# Altium schematic sheet ESP32墨水屏开发板_2023-03-20.schdoc
size 439 x 307 mm
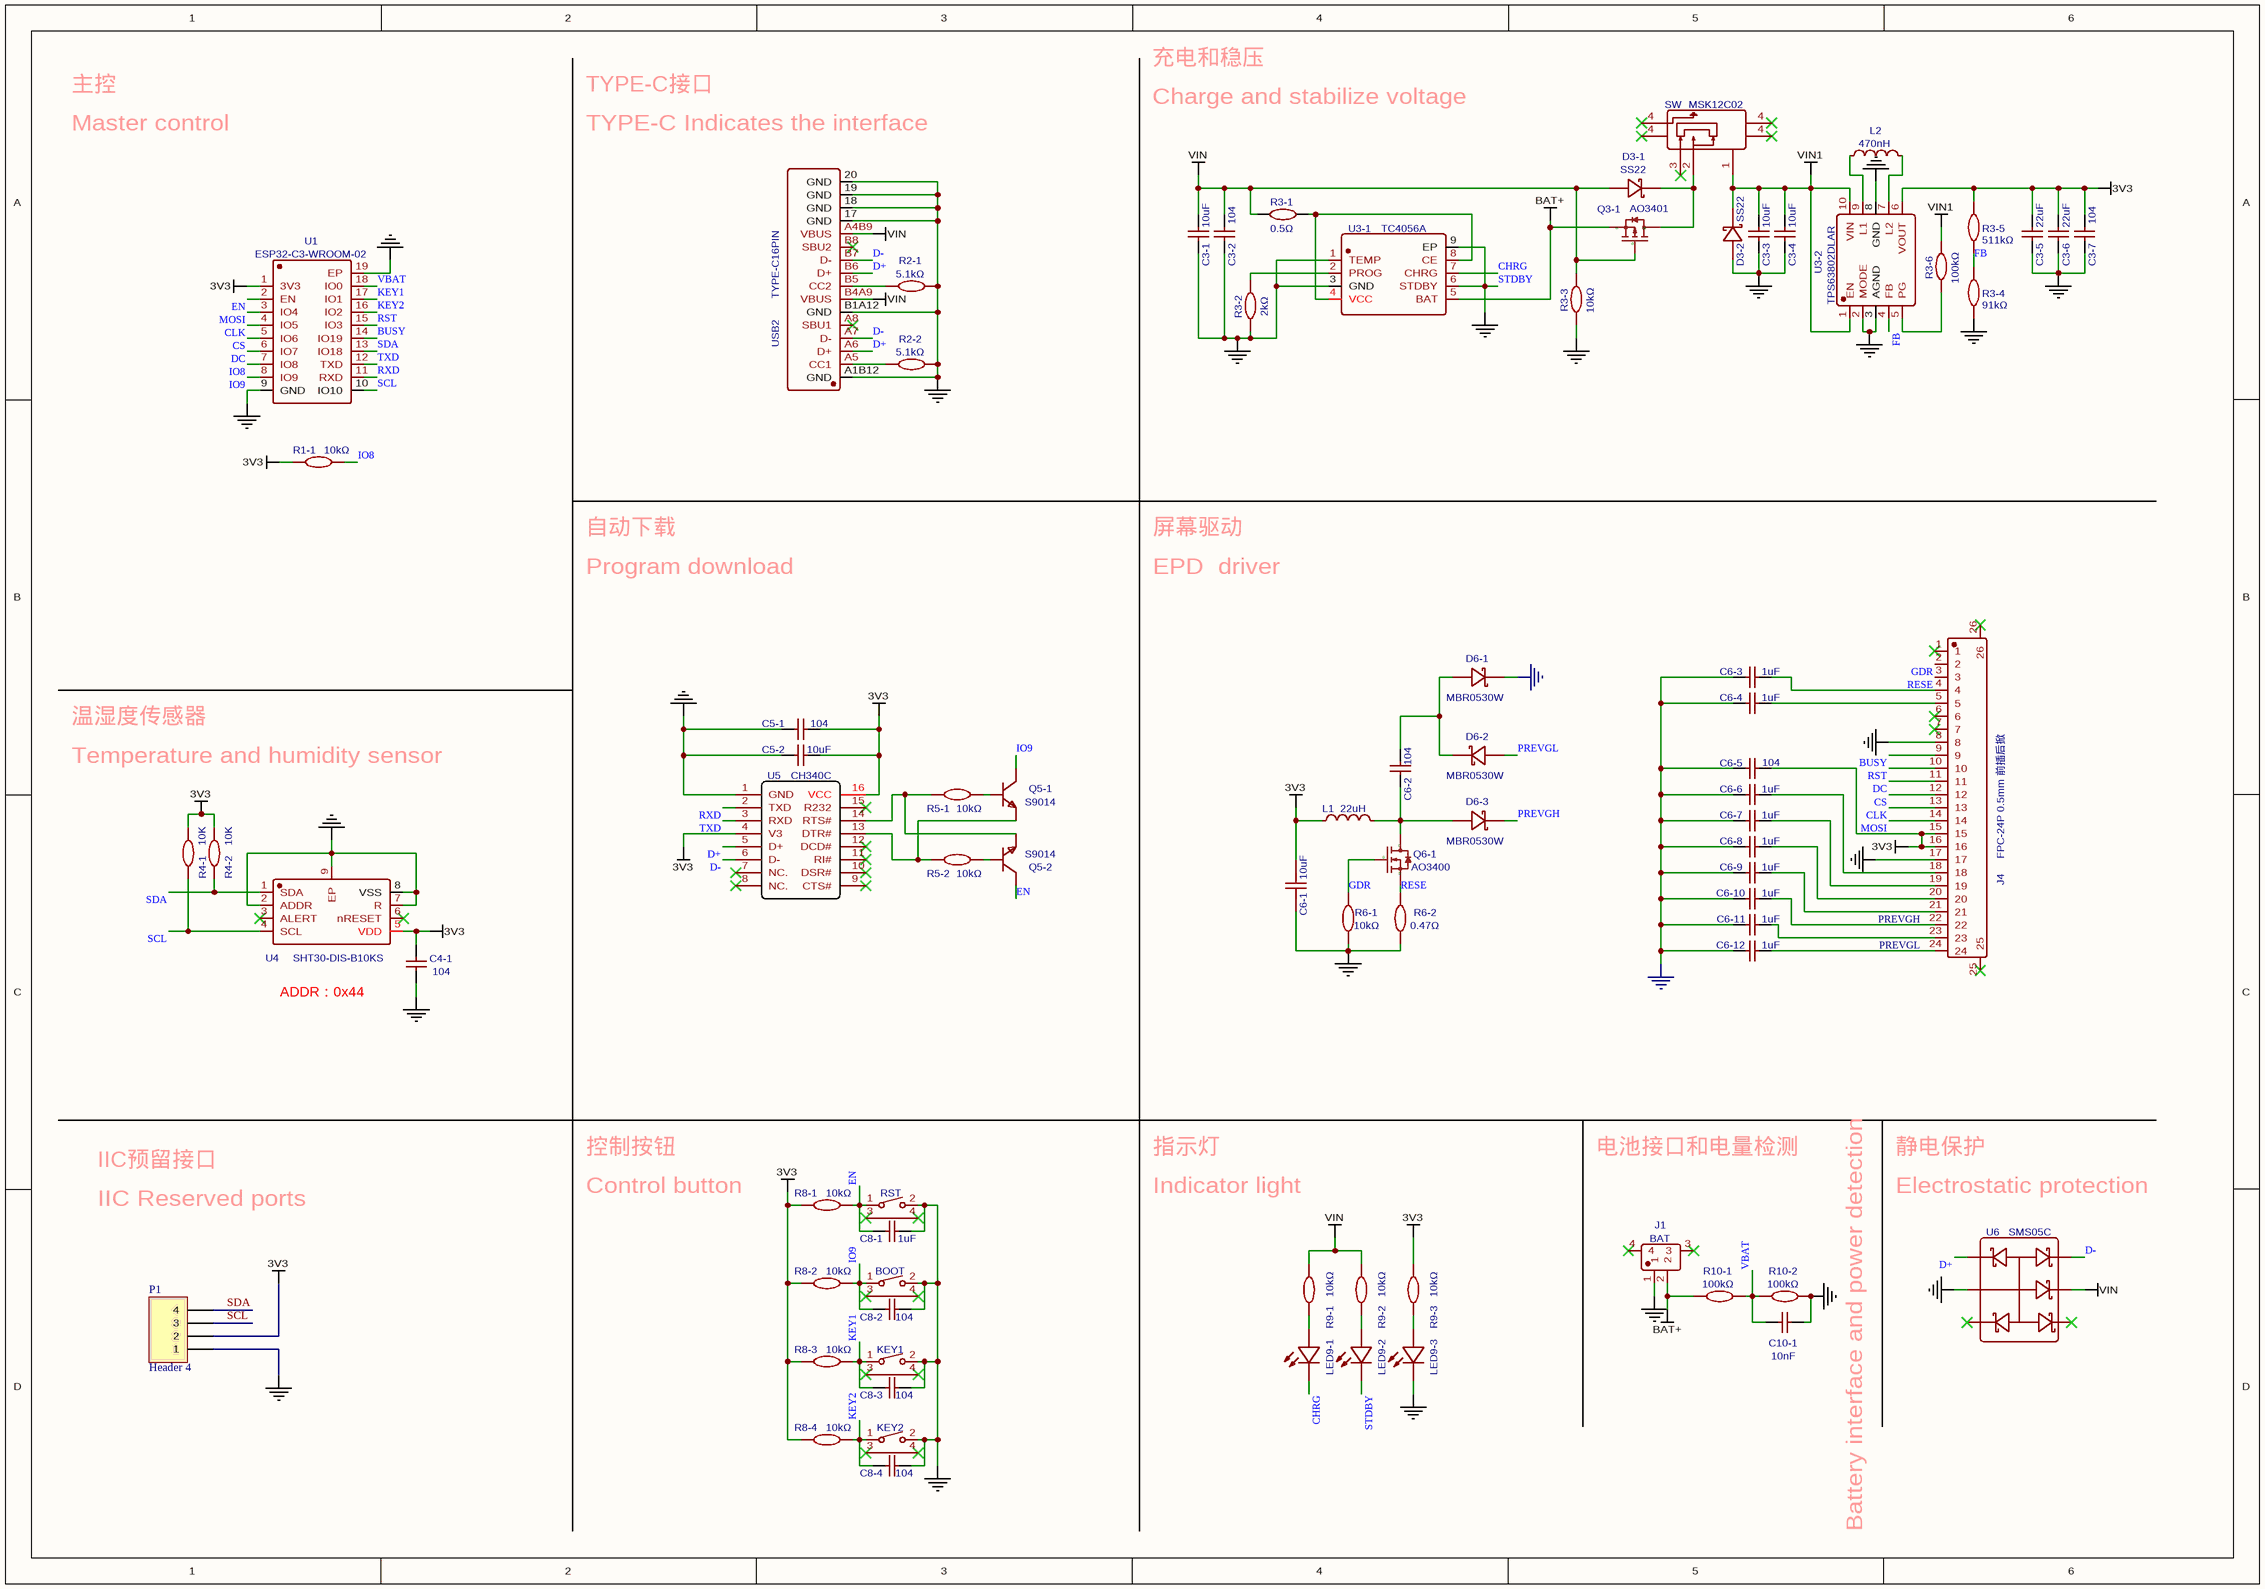
[diagram p0: ESP32墨水屏开发板_2023-03-20.schdoc]

## Parts
BOOT  UK-B0246-SP25Y  [SW-SMD_UK-B0246-SP25Y]  (value not drawn)
C3-1  10uF  [C0603]
C3-2  104  [C0603]
C3-3  10uF  [C0603]
C3-4  10uF  [C0603]
C3-5  22uF  [C0603]
C3-6  22uF  [C0603]
C3-7  104  [C0603]
C4-1  104  [C0603]
C5-1  104  [C0603]
C5-2  10uF  [C0603]
C6-1  10uF  [C0805]
C6-2  104  [C0603]
C6-3  1uF  [C0603]
C6-4  1uF  [C0603]
C6-5  104  [C0603]
C6-6  1uF  [C0603]
C6-7  1uF  [C0603]
C6-8  1uF  [C0603]
C6-9  1uF  [C0603]
C6-10  1uF  [C0603]
C6-11  1uF  [C0603]
C6-12  1uF  [C0603]
C8-1  1uF  [C0603]
C8-2  104  [C0603]
C8-3  104  [C0603]
C8-4  104  [C0603]
C10-1  10nF  [C0603]
D3-1  SS22  [SMA_L4.3-W2.5-LS5.0-R-RD]
D3-2  SS22  [SMA_L4.3-W2.5-LS5.0-R-RD]
D6-1  MBR0530W  [SOD-123_L2.7-W1.7-LS3.8-RD]
D6-2  MBR0530W  [SOD-123_L2.7-W1.7-LS3.8-RD]
D6-3  MBR0530W  [SOD-123_L2.7-W1.7-LS3.8-RD]
J1  BAT  [CONN-SMD_XH2.54-2PSMD]
J4  FPC-24P 0.5mm 前插后掀  [FPC-SMD_X05A26H24G]
KEY1  UK-B0246-SP25Y  [SW-SMD_UK-B0246-SP25Y]  (value not drawn)
KEY2  UK-B0246-SP25Y  [SW-SMD_UK-B0246-SP25Y]  (value not drawn)
L1  22uH  [IND-SMD_L2.5-W2.0_SWPA252012S]
L2  470nH  [L0805]
LED9-1  RED  [LED0603-RD]  (value not drawn)
LED9-2  RED  [LED0603-RD]  (value not drawn)
LED9-3  RED  [LED0603-RD]  (value not drawn)
P1  Header 4  [HDR1X4]
Q3-1  AO3401  [SOT-23-3_L2.9-W1.3-P1.90-LS2.4-BR]
Q5-1  S9014  [SOT-23-3_L2.9-W1.3-P1.90-LS2.4-BR]
Q5-2  S9014  [SOT-23-3_L2.9-W1.3-P1.90-LS2.4-BR]
Q6-1  AO3400  [SC-59-3_L2.9-W1.5-P0.95-LS2.5-BR]
R1-1  10kΩ  [R0603]
R2-1  5.1kΩ  [R0603]
R2-2  5.1kΩ  [R0603]
R3-1  0.5Ω  [R1206]
R3-2  2kΩ  [R0603]
R3-3  10kΩ  [R0603]
R3-4  91kΩ  [R0603]
R3-5  511kΩ  [R0603]
R3-6  100kΩ  [R0603]
R4-1  10K  [R0603]
R4-2  10K  [R0603]
R5-1  10kΩ  [R0603]
R5-2  10kΩ  [R0603]
R6-1  10kΩ  [R0603]
R6-2  0.47Ω  [R0603]
R8-1  10kΩ  [R0603]
R8-2  10kΩ  [R0603]
R8-3  10kΩ  [R0603]
R8-4  10kΩ  [R0603]
R9-1  10kΩ  [R0603]
R9-2  10kΩ  [R0603]
R9-3  10kΩ  [R0603]
R10-1  100kΩ  [R0603]
R10-2  100kΩ  [R0603]
RST  UK-B0246-SP25Y  [SW-SMD_UK-B0246-SP25Y]  (value not drawn)
SW  MSK12C02  [SW-TH_MSK12C02]
U1  ESP32-C3-WROOM-02  [BULETM-SMD_ESPRESSIF_ESP32-C3-WROOM-02-N4-4MB]
U3-1  TC4056A  [SOP-8_L4.9-W3.9-P1.27-LS6.0-BL-EP]
U3-2  TPS63802DLAR  [VSON-10_L3.0-W2.0-P0.50-BL_TI_DLA0010A]
U4  SHT30-DIS-B10KS  [DFN-8_L2.5-W2.5-P0.50-BL-EP]
U5  CH340C  [SOP-16_L10.0-W3.9-P1.27-LS6.0-BL]
U6  SMS05C  [SOT-23-6_L2.9-W1.6-P0.95-LS2.8-BL]
USB2  TYPE-C16PIN  [USB-SMD_TYPE-C16PIN-1]

## Nets
3V3: C3-5.2 C3-6.2 C3-7.2 C4-1.2 C5-1.1 C5-2.1 C6-1.2 C6-5.1 J4.15 J4.16 L1.1 P1.2 R1-1.2 R3-5.1 R4-1.2 R4-2.2 R8-1.1 R8-2.1 R8-3.1 R8-4.1 R9-3.2 U1.1(3V3) U3-2.6(VOUT) U4.5(VDD) U5.4(V3) U5.16(VCC)
BAT+: J1.2 Q3-1.2(S) R10-1.2 U3-1.5(BAT)
STDBY: BOOT.2 C3-1.1 C3-2.1 C3-3.1 C3-4.1 C3-5.1 C3-6.1 C3-7.1 C4-1.1 C5-1.2 C5-2.2 C6-1.1 C6-3.1 C6-4.1 C6-5.2 C6-6.1 C6-7.1 C6-8.1 C6-9.1 C6-10.1 C6-11.1 C6-12.1 C8-1.1 C8-2.2 C8-3.2 C8-4.2 C10-1.1 D3-2.1(A) D6-1.1 J1.1 J4.8 J4.17 KEY1.2 KEY2.2 LED9-2.1(K) LED9-3.1(K) P1.1 R2-1.2 R2-2.2 R3-2.1 R3-3.1 R3-4.2 R6-1.1 R6-2.1 R10-2.1 RST.2 U1.9(GND) U1.19(EP) U3-1.1(TEMP) U3-1.3(GND) U3-1.6(STDBY) U3-1.9(EP) U3-2.2(MODE) U3-2.3(AGND) U3-2.8(GND) U4.2(ADDR) U4.7(R) U4.8(VSS) U4.9(EP) U5.1(GND) U6.2 USB2.17(GND) USB2.18(GND) USB2.19(GND) USB2.20(GND) USB2.A1B12(GND) USB2.B1A12(GND)  [also labelled GND]
VIN: C3-1.2 C3-2.2 D3-1.1(A) Q3-1.1(G) R3-1.2 R3-3.2 R9-1.2 R9-2.2 U6.5 USB2.A4B9(VBUS) USB2.B4A9(VBUS)
VIN1: C3-3.2 C3-4.2 D3-2.2(K) R3-6.2 SW.1 U3-2.1(EN) U3-2.10(VIN)
BUSY: J4.9 U1.14(IO19)
CHRG: LED9-1.1(K) U3-1.7(CHRG)
CLK: J4.13 U1.4(IO5)
CS: J4.12 U1.5(IO6)
D+: U5.5(D+) U6.1 USB2.A6(D+) USB2.B6(D+)
D-: U5.6(D-) U6.6 USB2.A7(D-) USB2.B7(D-)
DC: J4.11 U1.6(IO7)
EN: C8-1.2 Q5-2.3(C) R8-1.2 RST.1 U1.2(EN)
FB: R3-4.1 R3-5.2 U3-2.4(FB)
GDR: J4.2 Q6-1.1(G) R6-1.2
IO8: R1-1.1 U1.7(IO8)
IO9: BOOT.1 C8-2.1 Q5-1.3(C) R8-2.2 U1.8(IO9)
KEY1: C8-3.1 KEY1.1 R8-3.2 U1.17(IO1)
KEY2: C8-4.1 KEY2.1 R8-4.2 U1.16(IO2)
MOSI: J4.14 U1.3(IO4)
PREVGH: C6-9.2 D6-3.1 J4.21
PREVGL: C6-11.2 D6-2.2 J4.23
RESE: J4.3 Q6-1.2(S) R6-2.2
RST: J4.10 U1.15(IO3)
RXD: U1.11(RXD) U5.2(TXD)
SCL: P1.3 R4-1.1 U1.10(IO10) U4.4(SCL)
SDA: P1.4 R4-2.1 U1.13(IO18) U4.1(SDA)
TXD: U1.12(TXD) U5.3(RXD)
VBAT: C10-1.2 R10-1.1 R10-2.2 U1.18(IO0)
NetC6-2_1: C6-2.1 D6-3.2 L1.2 Q6-1.3(D)
NetC6-2_2: C6-2.2 D6-1.2 D6-2.1
NetC6-3_2: C6-3.2 J4.4
NetC6-4_2: C6-4.2 J4.5
NetC6-6_2: C6-6.2 J4.18
NetC6-7_2: C6-7.2 J4.19
NetC6-8_2: C6-8.2 J4.20
NetC6-10_2: C6-10.2 J4.22
NetC6-12_2: C6-12.2 J4.24
NetD3-1_2: D3-1.2(K) Q3-1.3(D) SW.2
NetL2_1: L2.1 U3-2.9(L1)
NetL2_2: L2.2 U3-2.7(L2)
NetLED9-1_2: LED9-1.2(A) R9-1.1
NetLED9-2_2: LED9-2.2(A) R9-2.1
NetLED9-3_2: LED9-3.2(A) R9-3.1
NetQ5-1_1: Q5-1.1(B) R5-1.2
NetQ5-1_2: Q5-1.2(E) R5-2.1 U5.13(DTR#)
NetQ5-2_1: Q5-2.1(B) R5-2.2
NetQ5-2_2: Q5-2.2(E) R5-1.1 U5.14(RTS#)
NetR2-1_1: R2-1.1 USB2.B5(CC2)
NetR2-2_1: R2-2.1 USB2.A5(CC1)
NetR3-1_1: R3-1.1 U3-1.4(VCC) U3-1.8(CE)
NetR3-2_2: R3-2.2 U3-1.2(PROG)
NetR3-6_1: R3-6.1 U3-2.5(PG)

Not connected (* = marked no-connect by the designer): BOOT 3(EP)* 4(EP)*; J1 3* 4*; J4 1* 6* 7* 25* 26*; KEY1 3(EP)* 4(EP)*; KEY2 3(EP)* 4(EP)*; RST 3(EP)* 4(EP)*; SW 3* 4*; U4 3(ALERT)* 6(nRESET)*; U5 7(NC.)* 8(NC.)* 9(CTS#)* 10(DSR#)* 11(RI#)* 12(DCD#)* 15(R232)*; U6 3* 4*; USB2 A8(SBU1)* B8(SBU2)*

## Notes on the sheet
- 主控
- TYPE-C接口
- 充电和稳压
- Charge and stabilize voltage
- Master control
- (near USB2) TYPE-C Indicates the interface
- 自动下载
- 屏幕驱动
- Program download
- EPD  driver
- 温湿度传感器
- Temperature and humidity sensor
- ADDR：0x44
- IIC预留接口
- IIC Reserved ports
- 控制按钮
- Control button
- 指示灯
- Indicator light
- 电池接口和电量检测
- 静电保护
- Electrostatic protection
- Battery interface and power detection

## Library data of the parts
BOOT KEY1 KEY2 RST = UK-B0246-SP25Y: BOM_Manufacturer: USAKRO; Contributor: LCSC; Package Display: No; BOM_Supplier: LCSC; BOM_Supplier Part: C493279; BOM_Manufacturer Part: UK-B0246-SP25Y; BOM_JLCPCB Part Class: Extended Part; spicePre: S; spiceSymbolName: UK-B0246-SP25Y
C3-1 C3-3 C3-4 C5-2 = 10uF: BOM_Manufacturer: YAGEO; BOM_Manufacturer Part: CC0603MRX5R5BB106; nameAlias: Capacitance; BOM_Supplier: LCSC; BOM_Supplier Part: C109454; BOM_JLCPCB Part Class: Extended Part; spicePre: C; spiceSymbolName: CC0603MRX5R5BB106
C3-2 C3-7 C4-1 C5-1 C6-2 C6-5 C8-2-C8-4 = 104: BOM_Manufacturer: KEMET; BOM_Manufacturer Part: C0603C104K5RACTU; nameAlias: Capacitance; Contributor: LCSC; BOM_Supplier: LCSC; BOM_Supplier Part: C127833; BOM_JLCPCB Part Class: Extended Part; spicePre: C; spiceSymbolName: C0603C104K5RACTU
C3-5 C3-6 = 22uF: BOM_Manufacturer: YAGEO; BOM_Manufacturer Part: CC0603MRX5R5BB106; nameAlias: Capacitance; BOM_Supplier: LCSC; BOM_Supplier Part: C109454; BOM_JLCPCB Part Class: Extended Part; spicePre: C; spiceSymbolName: CC0603MRX5R5BB106
C6-1 = 10uF: BOM_Manufacturer: SANYEAR(叁叶源); BOM_Manufacturer Part: C0805X6S106K350NT; nameAlias: Capacitance; Contributor: lcsc; BOM_Supplier: LCSC; BOM_Supplier Part: C2844304; link: https://atta.szlcsc.com/upload/public/pdf/source/20200102/C475251_1E30ECAC0E8AE7254982658A02A2D78C.pdf; BOM_JLCPCB Part Class: Extended Part; spicePre: C; spiceSymbolName: C0805X6S106K350NT
C6-3 C6-4 C6-6-C6-12 = 1uF: BOM_Manufacturer: YAGEO; BOM_Manufacturer Part: CC0603KRX5R7BB105; nameAlias: Capacitance; Contributor: LCSC; BOM_Supplier: LCSC; BOM_Supplier Part: C106215; BOM_JLCPCB Part Class: Extended Part; spicePre: C; spiceSymbolName: CC0603KRX5R7BB105
C8-1 = 1uF: BOM_Manufacturer: YAGEO; BOM_Manufacturer Part: CC0603MRX5R5BB106; nameAlias: Capacitance; BOM_Supplier: LCSC; BOM_Supplier Part: C109454; BOM_JLCPCB Part Class: Extended Part; spicePre: C; spiceSymbolName: CC0603MRX5R5BB106
C10-1 = 10nF: BOM_Manufacturer: KEMET; BOM_Manufacturer Part: C0603C104K5RACTU; nameAlias: Capacitance; Contributor: LCSC; BOM_Supplier: LCSC; BOM_Supplier Part: C127833; BOM_JLCPCB Part Class: Extended Part; spicePre: C; spiceSymbolName: C0603C104K5RACTU
D3-1 D3-2 = SS22: BOM_Manufacturer: TWGMC(台湾迪嘉); Contributor: LCSC; Package Display: No; BOM_Supplier: LCSC; BOM_Supplier Part: C727054; BOM_Manufacturer Part: SS22; BOM_JLCPCB Part Class: Extended Part; spicePre: D; spiceSymbolName: SS22_C727054
D6-1-D6-3 = MBR0530W: BOM_Manufacturer: Slkor(萨科微); BOM_Manufacturer Part: MBR0530W B3; Contributor: lcsc; Package Display: No; BOM_Supplier: LCSC; BOM_Supplier Part: C2965565; spicePre: D; spiceSymbolName: MBR0530W B3
J1 = BAT: BOM_Manufacturer: null; BOM_Manufacturer Part: XH2.54-2PSMD; Contributor: LCSC; BOM_Supplier: LCSC; BOM_Supplier Part: C9900001015; BOM_JLCPCB Part Class: Extended Part; link: https://cn.bing.com/search?q=datasheet: XH2.54-2PSMD; spicePre: U; spiceSymbolName: XH2.54-2PSMD
J4 = FPC-24P 0.5mm 前插后掀: BOM_Manufacturer: XKB Enterprise; BOM_Manufacturer Part: X05A26H24G; Contributor: LCSC; BOM_Supplier: LCSC; BOM_Supplier Part: C519265; BOM_JLCPCB Part Class: Extended Part; spicePre: F; spiceSymbolName: X05A26H24G
L1 = 22uH: BOM_Manufacturer: Shun Xiang Nuo Elec; BOM_Manufacturer Part: SMNR252012-220MT; nameAlias: Inductance; Contributor: LCSC; Package Display: No; BOM_Supplier: LCSC; BOM_Supplier Part: C363229; BOM_JLCPCB Part Class: Extended Part; spicePre: L; spiceSymbolName: SMNR252012-220MT
L2 = 470nH: BOM_Manufacturer: Sunlord(顺络); BOM_Manufacturer Part: SDFL2012LR47KTF; nameAlias: Inductance; Package Display: No; BOM_Supplier: LCSC; BOM_Supplier Part: C48556; BOM_JLCPCB Part Class: Extended Part; spicePre: L; spiceSymbolName: SDFL2012LR47KTF
LED9-1-LED9-3 = RED: BOM_Manufacturer: MEIHUA; BOM_Manufacturer Part: MHT192JRCT; Contributor: LCSC; BOM_Supplier: LCSC; BOM_Supplier Part: C401120; BOM_JLCPCB Part Class: Extended Part; spicePre: L; spiceSymbolName: MHT192JRCT
P1 = Header 4: Header, 4-Pin; LatestRevisionDate: 17-Jul-2002; LatestRevisionNote: Re-released for DXP Platform.; Publisher: Altium Limited
Q3-1 = AO3401: BOM_Manufacturer: Hottech; Contributor: LCSC; Package Display: No; BOM_Supplier: LCSC; BOM_Manufacturer Part: AO3401; BOM_Supplier Part: C181091; spicePre: Q; spiceSymbolName: AO3401
Q5-1 Q5-2 = S9014: BOM_Manufacturer: FOSAN(富信); Contributor: LCSC; BOM_Supplier: LCSC; BOM_Supplier Part: C2926162; BOM_Manufacturer Part: S9014; BOM_JLCPCB Part Class: Extended Part; spicePre: Q; spiceSymbolName: S9014_C2926162
Q6-1 = AO3400: BOM_Manufacturer: SK; Contributor: 立创EDA官方封装库; BOM_Supplier: LCSC; BOM_Manufacturer Part: AO3400; BOM_Supplier Part: C122850; BOM_JLCPCB Part Class: Extended Part; spicePre: Q; spiceSymbolName: AO3400_C122850
R1-1 R3-3 R5-1 R5-2 R6-1 R8-1-R8-4 R9-1-R9-3 = 10kΩ: BOM_Manufacturer: SANYEAR; BOM_Manufacturer Part: SY0603JN10KP; Resistance (Ohms): 10K; nameAlias: Resistance; Contributor: LCSC; BOM_Supplier: LCSC; BOM_Supplier Part: C380762; BOM_JLCPCB Part Class: Extended Part; spicePre: R; spiceSymbolName: SY0603JN10KP
R2-1 R2-2 = 5.1kΩ: BOM_Manufacturer: ResistorToday; BOM_Manufacturer Part: PTFR0603D5K10P9; Resistance (Ohms): 5.1K; nameAlias: Resistance; Contributor: LCSC; BOM_Supplier: LCSC; BOM_Supplier Part: C369945; BOM_JLCPCB Part Class: Extended Part; spicePre: R; spiceSymbolName: PTFR0603D5K10P9
R3-1 = 0.5Ω: BOM_Manufacturer: RALEC; BOM_Manufacturer Part: RTT06R500FTP; nameAlias: Resistance; Resistance (Ohms): 0.5; BOM_Supplier: LCSC; BOM_Supplier Part: C104947; BOM_JLCPCB Part Class: Extended Part; spicePre: R; spiceSymbolName: RTT06R500FTP
R3-2 = 2kΩ: BOM_Manufacturer: SANYEAR; BOM_Manufacturer Part: SY0603JN10KP; Resistance (Ohms): 10K; nameAlias: Resistance; Contributor: LCSC; BOM_Supplier: LCSC; BOM_Supplier Part: C380762; BOM_JLCPCB Part Class: Extended Part; spicePre: R; spiceSymbolName: SY0603JN10KP
R3-4 = 91kΩ: BOM_Manufacturer: ResistorToday; BOM_Manufacturer Part: PTFR0603D5K10P9; Resistance (Ohms): 5.1K; nameAlias: Resistance; Contributor: LCSC; BOM_Supplier: LCSC; BOM_Supplier Part: C369945; BOM_JLCPCB Part Class: Extended Part; spicePre: R; spiceSymbolName: PTFR0603D5K10P9
R3-5 = 511kΩ: BOM_Manufacturer: ResistorToday; BOM_Manufacturer Part: PTFR0603D5K10P9; Resistance (Ohms): 5.1K; nameAlias: Resistance; Contributor: LCSC; BOM_Supplier: LCSC; BOM_Supplier Part: C369945; BOM_JLCPCB Part Class: Extended Part; spicePre: R; spiceSymbolName: PTFR0603D5K10P9
R3-6 = 100kΩ: BOM_Manufacturer: SANYEAR; BOM_Manufacturer Part: SY0603JN10KP; Resistance (Ohms): 10K; nameAlias: Resistance; Contributor: LCSC; BOM_Supplier: LCSC; BOM_Supplier Part: C380762; BOM_JLCPCB Part Class: Extended Part; spicePre: R; spiceSymbolName: SY0603JN10KP
R4-1 R4-2 = 10K: BOM_Manufacturer: SANYEAR; BOM_Manufacturer Part: SY0603JN10KP; nameAlias: Resistance; Contributor: LCSC; BOM_Supplier: LCSC; BOM_Supplier Part: C380762; Resistance (Ohms): 10K; BOM_JLCPCB Part Class: Extended Part; spicePre: R; spiceSymbolName: SY0603JN10KP
R6-2 = 0.47Ω: BOM_Manufacturer: Ever Ohms Tech; BOM_Manufacturer Part: CR0603F0R47P05; nameAlias: Resistance; Contributor: LCSC; Resistance (Ohms): 0.47; BOM_Supplier: LCSC; BOM_Supplier Part: C175657; BOM_JLCPCB Part Class: Extended Part; spicePre: R; spiceSymbolName: CR0603F0R47P05
R10-1 = 100kΩ: BOM_Manufacturer: Tyohm; BOM_Manufacturer Part: RMC06034.7k5%N; Resistance (Ohms): 4.7K; nameAlias: Resistance; Contributor: LCSC; BOM_Supplier: LCSC; BOM_Supplier Part: C269694; BOM_JLCPCB Part Class: Extended Part; spicePre: R; spiceSymbolName: RMC06034.7K5%N
R10-2 = 100kΩ: BOM_Manufacturer: ResistorToday; BOM_Manufacturer Part: AECR0603F1K00K9; Resistance (Ohms): 1K; nameAlias: Resistance; Contributor: LCSC; BOM_Supplier: LCSC; BOM_Supplier Part: C328340; BOM_JLCPCB Part Class: Extended Part; spicePre: R; spiceSymbolName: AECR0603F1K00K9
SW = MSK12C02: BOM_Manufacturer: SHOU HAN; Contributor: LCSC; BOM_Supplier: LCSC; BOM_Supplier Part: C431540; BOM_Manufacturer Part: MSK12C02; BOM_JLCPCB Part Class: Extended Part; spicePre: S; spiceSymbolName: MSK12C02
U1 = ESP32-C3-WROOM-02: BOM_Manufacturer: ESPRESSIF(乐鑫); BOM_Manufacturer Part: ESP32-C3-WROOM-02-N4; Contributor: LCSC; Package Display: No; BOM_Supplier: LCSC; BOM_Supplier Part: C2934560; BOM_JLCPCB Part Class: Extended Part; spicePre: U; spiceSymbolName: ESP32-C3-WROOM-02-N4(4MB)
U3-1 = TC4056A: BOM_Manufacturer: FM; BOM_Supplier: LCSC; BOM_Manufacturer Part: TC4056A; BOM_Supplier Part: C84051; BOM_JLCPCB Part Class: Extended Part; spicePre: U; spiceSymbolName: TC4056A
U3-2 = TPS63802DLAR: BOM_Manufacturer: TI(德州仪器); Contributor: LCSC; Package Display: No; BOM_Supplier: LCSC; BOM_Supplier Part: C2845237; BOM_Manufacturer Part: TPS63802DLAR; BOM_JLCPCB Part Class: Extended Part; spicePre: U; spiceSymbolName: TPS63802DLAR
U4 = SHT30-DIS-B10KS: BOM_Manufacturer: Sensirion(瑞士盛思锐); Contributor: LCSC; Package Display: No; BOM_Supplier: LCSC; BOM_Supplier Part: C2687423; BOM_Manufacturer Part: SHT30-DIS-B10KS; BOM_JLCPCB Part Class: Extended Part; spicePre: U; spiceSymbolName: SHT30-DIS-B10KS
U5 = CH340C: BOM_Manufacturer: WCH(南京沁恒); Package Display: No; BOM_Supplier: LCSC; BOM_Manufacturer Part: CH340C; BOM_Supplier Part: C84681; BOM_JLCPCB Part Class: Extended Part; spicePre: U; spiceSymbolName: CH340C
U6 = SMS05C: BOM_Manufacturer: TECH PUBLIC(台舟); Contributor: lcsc; BOM_Supplier: LCSC; BOM_Supplier Part: C2827671; BOM_Manufacturer Part: SMS05C; BOM_JLCPCB Part Class: Extended Part; spicePre: D; spiceSymbolName: SMS05C
USB2 = TYPE-C16PIN: BOM_Manufacturer Part: TYPE-C16PIN四脚插板母座5A大电流; Contributor: LCSC; BOM_Supplier: LCSC; BOM_Supplier Part: C2894751; BOM_JLCPCB Part Class: Extended Part; spicePre: U; spiceSymbolName: TYPE-C16PIN四脚插板母座5A大电流